# Altium schematic sheet InternalConnection.SchDoc
size 420 x 297 mm; Address1: Address1; Address2: Address2; Address3: Address3; Address4: Address4; SheetNumber: 2; SheetTotal: 5; Scale: 1:1; DocumentType: Схема электрическая принципиальная
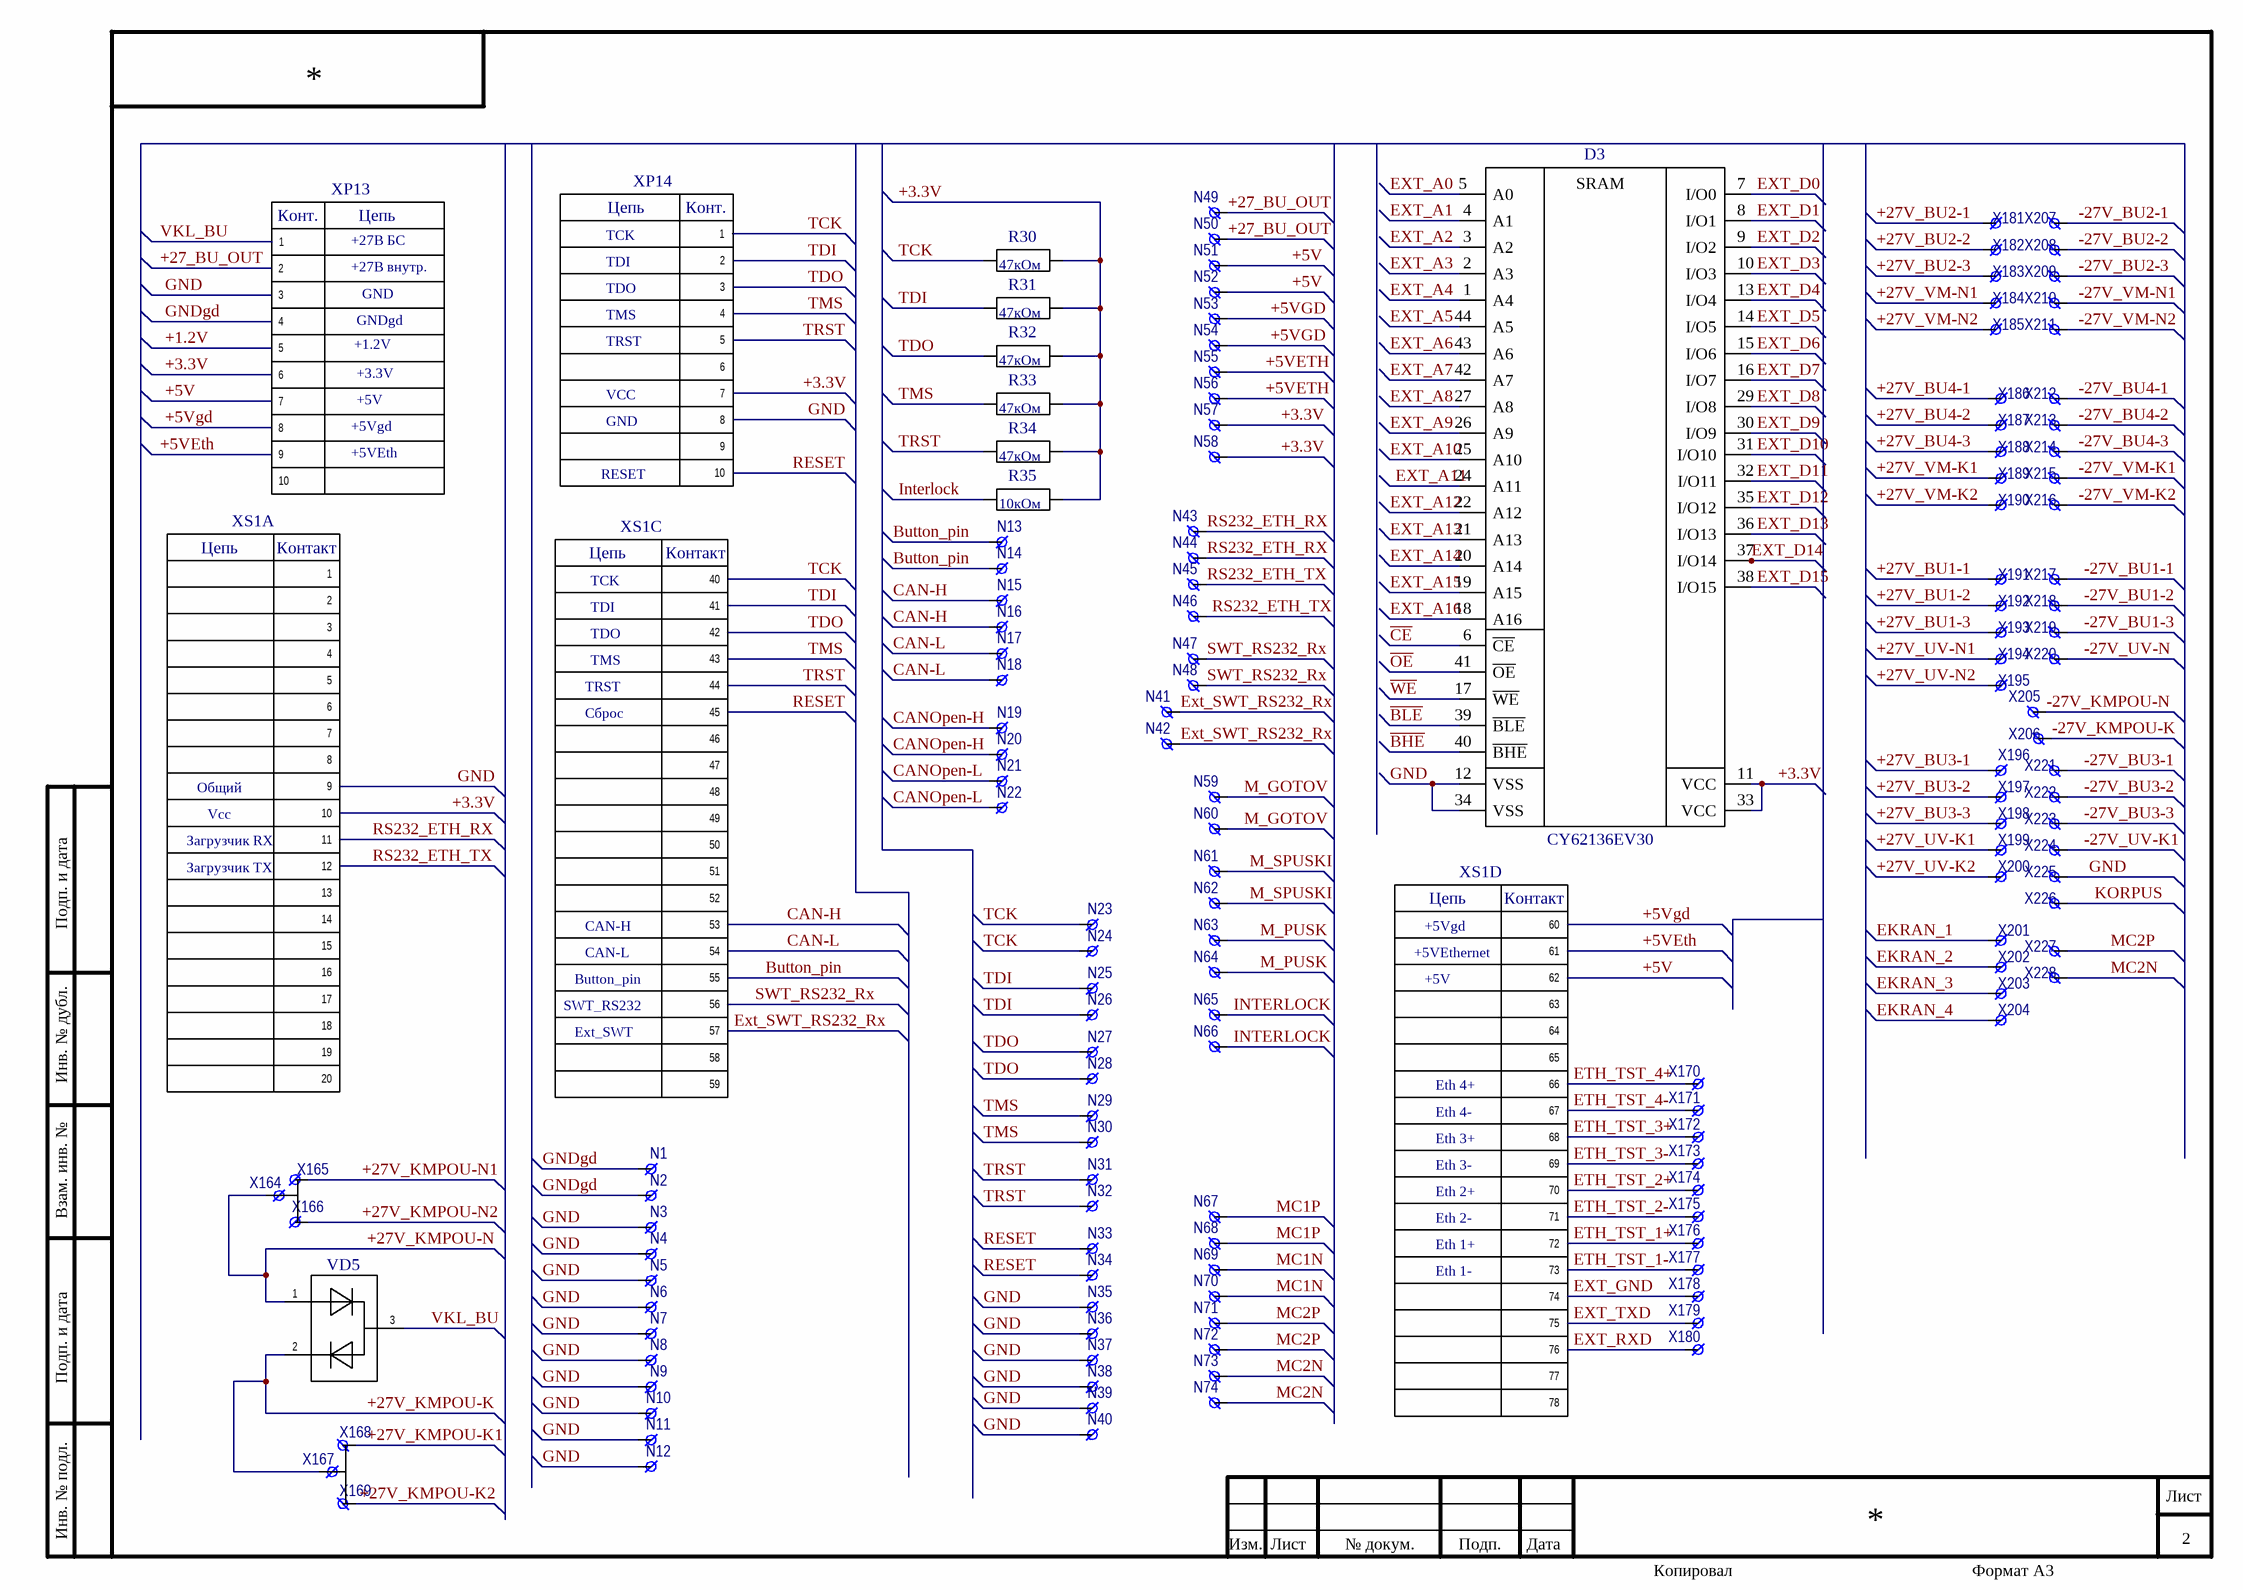
[diagram p0: InternalConnection.SchDoc]

## Parts
D3  CY62136EV30  [TSOP-44]
N1  CONT  [ПЛАН_ПЛОЩ]  (value not drawn)
N2  CONT  [ПЛАН_ПЛОЩ]  (value not drawn)
N3  CONT  [ПЛАН_ПЛОЩ]  (value not drawn)
N4  CONT  [ПЛАН_ПЛОЩ]  (value not drawn)
N5  CONT  [ПЛАН_ПЛОЩ]  (value not drawn)
N6  CONT  [ПЛАН_ПЛОЩ]  (value not drawn)
N7  CONT  [ПЛАН_ПЛОЩ]  (value not drawn)
N8  CONT  [ПЛАН_ПЛОЩ]  (value not drawn)
N9  CONT  [ПЛАН_ПЛОЩ]  (value not drawn)
N10  CONT  [ПЛАН_ПЛОЩ]  (value not drawn)
N11  CONT  [ПЛАН_ПЛОЩ]  (value not drawn)
N12  CONT  [ПЛАН_ПЛОЩ]  (value not drawn)
N13  CONT  [ПЛАН_ПЛОЩ]  (value not drawn)
N14  CONT  [ПЛАН_ПЛОЩ]  (value not drawn)
N15  CONT  [ПЛАН_ПЛОЩ]  (value not drawn)
N16  CONT  [ПЛАН_ПЛОЩ]  (value not drawn)
N17  CONT  [ПЛАН_ПЛОЩ]  (value not drawn)
N18  CONT  [ПЛАН_ПЛОЩ]  (value not drawn)
N19  CONT  [ПЛАН_ПЛОЩ]  (value not drawn)
N20  CONT  [ПЛАН_ПЛОЩ]  (value not drawn)
N21  CONT  [ПЛАН_ПЛОЩ]  (value not drawn)
N22  CONT  [ПЛАН_ПЛОЩ]  (value not drawn)
N23  CONT  [ПЛАН_ПЛОЩ]  (value not drawn)
N24  CONT  [ПЛАН_ПЛОЩ]  (value not drawn)
N25  CONT  [ПЛАН_ПЛОЩ]  (value not drawn)
N26  CONT  [ПЛАН_ПЛОЩ]  (value not drawn)
N27  CONT  [ПЛАН_ПЛОЩ]  (value not drawn)
N28  CONT  [ПЛАН_ПЛОЩ]  (value not drawn)
N29  CONT  [ПЛАН_ПЛОЩ]  (value not drawn)
N30  CONT  [ПЛАН_ПЛОЩ]  (value not drawn)
N31  CONT  [ПЛАН_ПЛОЩ]  (value not drawn)
N32  CONT  [ПЛАН_ПЛОЩ]  (value not drawn)
N33  CONT  [ПЛАН_ПЛОЩ]  (value not drawn)
N34  CONT  [ПЛАН_ПЛОЩ]  (value not drawn)
N35  CONT  [ПЛАН_ПЛОЩ]  (value not drawn)
N36  CONT  [ПЛАН_ПЛОЩ]  (value not drawn)
N37  CONT  [ПЛАН_ПЛОЩ]  (value not drawn)
N38  CONT  [ПЛАН_ПЛОЩ]  (value not drawn)
N39  CONT  [ПЛАН_ПЛОЩ]  (value not drawn)
N40  CONT  [ПЛАН_ПЛОЩ]  (value not drawn)
N41  CONT  [ПЛАН_ПЛОЩ]  (value not drawn)
N42  CONT  [ПЛАН_ПЛОЩ]  (value not drawn)
N43  CONT  [ПЛАН_ПЛОЩ]  (value not drawn)
N44  CONT  [ПЛАН_ПЛОЩ]  (value not drawn)
N45  CONT  [ПЛАН_ПЛОЩ]  (value not drawn)
N46  CONT  [ПЛАН_ПЛОЩ]  (value not drawn)
N47  CONT  [ПЛАН_ПЛОЩ]  (value not drawn)
N48  CONT  [ПЛАН_ПЛОЩ]  (value not drawn)
N49  CONT  [ПЛАН_ПЛОЩ]  (value not drawn)
N50  CONT  [ПЛАН_ПЛОЩ]  (value not drawn)
N51  CONT  [ПЛАН_ПЛОЩ]  (value not drawn)
N52  CONT  [ПЛАН_ПЛОЩ]  (value not drawn)
N53  CONT  [ПЛАН_ПЛОЩ]  (value not drawn)
N54  CONT  [ПЛАН_ПЛОЩ]  (value not drawn)
N55  CONT  [ПЛАН_ПЛОЩ]  (value not drawn)
N56  CONT  [ПЛАН_ПЛОЩ]  (value not drawn)
N57  CONT  [ПЛАН_ПЛОЩ]  (value not drawn)
N58  CONT  [ПЛАН_ПЛОЩ]  (value not drawn)
N59  CONT  [ПЛАН_ПЛОЩ]  (value not drawn)
N60  CONT  [ПЛАН_ПЛОЩ]  (value not drawn)
N61  CONT  [ПЛАН_ПЛОЩ]  (value not drawn)
N62  CONT  [ПЛАН_ПЛОЩ]  (value not drawn)
N63  CONT  [ПЛАН_ПЛОЩ]  (value not drawn)
N64  CONT  [ПЛАН_ПЛОЩ]  (value not drawn)
N65  CONT  [ПЛАН_ПЛОЩ]  (value not drawn)
N66  CONT  [ПЛАН_ПЛОЩ]  (value not drawn)
N67  CONT  [ПЛАН_ПЛОЩ]  (value not drawn)
N68  CONT  [ПЛАН_ПЛОЩ]  (value not drawn)
N69  CONT  [ПЛАН_ПЛОЩ]  (value not drawn)
N70  CONT  [ПЛАН_ПЛОЩ]  (value not drawn)
N71  CONT  [ПЛАН_ПЛОЩ]  (value not drawn)
N72  CONT  [ПЛАН_ПЛОЩ]  (value not drawn)
N73  CONT  [ПЛАН_ПЛОЩ]  (value not drawn)
N74  CONT  [ПЛАН_ПЛОЩ]  (value not drawn)
R30  47кОм  [P1-12-0.125(0805)]
R31  47кОм  [P1-12-0.125(0805)]
R32  47кОм  [P1-12-0.125(0805)]
R33  47кОм  [P1-12-0.125(0805)]
R34  47кОм  [P1-12-0.125(0805)]
R35  10кОм  [P1-12-0.125(0805)]
VD5  2Д707АС9  [KT-46]  (value not drawn)
X164  CONT  [ПЛАН_ПЛОЩ]  (value not drawn)
X165  CONT  [ПЛАН_ПЛОЩ]  (value not drawn)
X166  CONT  [ПЛАН_ПЛОЩ]  (value not drawn)
X167  CONT  [ПЛАН_ПЛОЩ]  (value not drawn)
X168  CONT  [ПЛАН_ПЛОЩ]  (value not drawn)
X169  CONT  [ПЛАН_ПЛОЩ]  (value not drawn)
X170  CONT  [ПЛАН_ПЛОЩ]  (value not drawn)
X171  CONT  [ПЛАН_ПЛОЩ]  (value not drawn)
X172  CONT  [ПЛАН_ПЛОЩ]  (value not drawn)
X173  CONT  [ПЛАН_ПЛОЩ]  (value not drawn)
X174  CONT  [ПЛАН_ПЛОЩ]  (value not drawn)
X175  CONT  [ПЛАН_ПЛОЩ]  (value not drawn)
X176  CONT  [ПЛАН_ПЛОЩ]  (value not drawn)
X177  CONT  [ПЛАН_ПЛОЩ]  (value not drawn)
X178  CONT  [ПЛАН_ПЛОЩ]  (value not drawn)
X179  CONT  [ПЛАН_ПЛОЩ]  (value not drawn)
X180  CONT  [ПЛАН_ПЛОЩ]  (value not drawn)
X181  CONT  [ПЛАН_ПЛОЩ]  (value not drawn)
X182  CONT  [ПЛАН_ПЛОЩ]  (value not drawn)
X183  CONT  [ПЛАН_ПЛОЩ]  (value not drawn)
X184  CONT  [ПЛАН_ПЛОЩ]  (value not drawn)
X185  CONT  [ПЛАН_ПЛОЩ]  (value not drawn)
X186  CONT  [ПЛАН_ПЛОЩ]  (value not drawn)
X187  CONT  [ПЛАН_ПЛОЩ]  (value not drawn)
X188  CONT  [ПЛАН_ПЛОЩ]  (value not drawn)
X189  CONT  [ПЛАН_ПЛОЩ]  (value not drawn)
X190  CONT  [ПЛАН_ПЛОЩ]  (value not drawn)
X191  CONT  [ПЛАН_ПЛОЩ]  (value not drawn)
X192  CONT  [ПЛАН_ПЛОЩ]  (value not drawn)
X193  CONT  [ПЛАН_ПЛОЩ]  (value not drawn)
X194  CONT  [ПЛАН_ПЛОЩ]  (value not drawn)
X195  CONT  [ПЛАН_ПЛОЩ]  (value not drawn)
X196  CONT  [ПЛАН_ПЛОЩ]  (value not drawn)
X197  CONT  [ПЛАН_ПЛОЩ]  (value not drawn)
X198  CONT  [ПЛАН_ПЛОЩ]  (value not drawn)
X199  CONT  [ПЛАН_ПЛОЩ]  (value not drawn)
X200  CONT  [ПЛАН_ПЛОЩ]  (value not drawn)
X201  CONT  [ПЛАН_ПЛОЩ]  (value not drawn)
X202  CONT  [ПЛАН_ПЛОЩ]  (value not drawn)
X203  CONT  [ПЛАН_ПЛОЩ]  (value not drawn)
X204  CONT  [ПЛАН_ПЛОЩ]  (value not drawn)
X205  CONT  [ПЛАН_ПЛОЩ]  (value not drawn)
X206  CONT  [ПЛАН_ПЛОЩ]  (value not drawn)
X207  CONT  [ПЛАН_ПЛОЩ]  (value not drawn)
X208  CONT  [ПЛАН_ПЛОЩ]  (value not drawn)
X209  CONT  [ПЛАН_ПЛОЩ]  (value not drawn)
X210  CONT  [ПЛАН_ПЛОЩ]  (value not drawn)
X211  CONT  [ПЛАН_ПЛОЩ]  (value not drawn)
X212  CONT  [ПЛАН_ПЛОЩ]  (value not drawn)
X213  CONT  [ПЛАН_ПЛОЩ]  (value not drawn)
X214  CONT  [ПЛАН_ПЛОЩ]  (value not drawn)
X215  CONT  [ПЛАН_ПЛОЩ]  (value not drawn)
X216  CONT  [ПЛАН_ПЛОЩ]  (value not drawn)
X217  CONT  [ПЛАН_ПЛОЩ]  (value not drawn)
X218  CONT  [ПЛАН_ПЛОЩ]  (value not drawn)
X219  CONT  [ПЛАН_ПЛОЩ]  (value not drawn)
X220  CONT  [ПЛАН_ПЛОЩ]  (value not drawn)
X221  CONT  [ПЛАН_ПЛОЩ]  (value not drawn)
X222  CONT  [ПЛАН_ПЛОЩ]  (value not drawn)
X223  CONT  [ПЛАН_ПЛОЩ]  (value not drawn)
X224  CONT  [ПЛАН_ПЛОЩ]  (value not drawn)
X225  CONT  [ПЛАН_ПЛОЩ]  (value not drawn)
X226  CONT  [ПЛАН_ПЛОЩ]  (value not drawn)
X227  CONT  [ПЛАН_ПЛОЩ]  (value not drawn)
X228  CONT  [ПЛАН_ПЛОЩ]  (value not drawn)
XP13  PBS-10(R)  [PBS-10R]  (value not drawn)
XP14  ARM10PIN_КОНТ  [PLD-10]  (value not drawn)
XS1  ВИЛКА DS1077-78M  [DS-1077-78F]  (value not drawn)  (parts A,C,D of 4)

## Nets
+1.2V: XP13.5
+3.3V: D3.11(VCC) D3.33(VCC) N57.1 N58.1 R30.2 R31.2 R32.2 R33.2 R34.2 R35.2 XP13.6 XP14.7 XS1.10
+5V: N51.1 N52.1 XP13.7 XS1.62
+5VETH: N55.1 N56.1 XP13.9 XS1.61
+5VGD: N53.1 N54.1 XP13.8 XS1.60
+27_BU_OUT: N49.1 N50.1 XP13.2
+27V_BU1-1: X191.1
+27V_BU1-2: X192.1
+27V_BU1-3: X193.1
+27V_BU2-1: X181.1
+27V_BU2-2: X182.1
+27V_BU2-3: X183.1
+27V_BU3-1: X196.1
+27V_BU3-2: X197.1
+27V_BU3-3: X198.1
+27V_BU4-1: X186.1
+27V_BU4-2: X187.1
+27V_BU4-3: X188.1
+27V_KMPOU-K: VD5.2 X167.1
+27V_KMPOU-K1: X168.1
+27V_KMPOU-K2: X169.1
+27V_KMPOU-N: VD5.1 X164.1
+27V_KMPOU-N1: X165.1
+27V_KMPOU-N2: X166.1
+27V_UV-K1: X199.1
+27V_UV-K2: X200.1
+27V_UV-N1: X194.1
+27V_UV-N2: X195.1
+27V_VM-K1: X189.1
+27V_VM-K2: X190.1
+27V_VM-N1: X184.1
+27V_VM-N2: X185.1
-27V_BU1-1: X217.1
-27V_BU1-2: X218.1
-27V_BU1-3: X219.1
-27V_BU2-1: X207.1
-27V_BU2-2: X208.1
-27V_BU2-3: X209.1
-27V_BU3-1: X221.1
-27V_BU3-2: X222.1
-27V_BU3-3: X223.1
-27V_BU4-1: X212.1
-27V_BU4-2: X213.1
-27V_BU4-3: X214.1
-27V_KMPOU-K: X206.1
-27V_KMPOU-N: X205.1
-27V_UV-K1: X224.1
-27V_UV-N: X220.1
-27V_VM-K1: X215.1
-27V_VM-K2: X216.1
-27V_VM-N1: X210.1
-27V_VM-N2: X211.1
~{BHE}: D3.40(~{BHE})
~{BLE}: D3.39(~{BLE})
~{CE}: D3.6(~{CE})
~{OE}: D3.41(~{OE})
~{WE}: D3.17(~{WE})
Button_pin: N13.1 N14.1 XS1.55
CAN-H: N15.1 N16.1 XS1.53
CAN-L: N17.1 N18.1 XS1.54
CANOpen-H: N19.1 N20.1
CANOpen-L: N21.1 N22.1
EKRAN_1: X201.1
EKRAN_2: X202.1
EKRAN_3: X203.1
EKRAN_4: X204.1
ETH_TST_1+: X176.1 XS1.72
ETH_TST_1-: X177.1 XS1.73
ETH_TST_2+: X174.1 XS1.70
ETH_TST_2-: X175.1 XS1.71
ETH_TST_3+: X172.1 XS1.68
ETH_TST_3-: X173.1 XS1.69
ETH_TST_4+: X170.1 XS1.66
ETH_TST_4-: X171.1 XS1.67
EXT_A0: D3.5(A0)
EXT_A1: D3.4(A1)
EXT_A2: D3.3(A2)
EXT_A3: D3.2(A3)
EXT_A4: D3.1(A4)
EXT_A5: D3.44(A5)
EXT_A6: D3.43(A6)
EXT_A7: D3.42(A7)
EXT_A8: D3.27(A8)
EXT_A9: D3.26(A9)
EXT_A10: D3.25(A10)
EXT_A11: D3.24(A11)
EXT_A12: D3.22(A12)
EXT_A13: D3.21(A13)
EXT_A14: D3.20(A14)
EXT_A15: D3.19(A15)
EXT_A16: D3.18(A16)
EXT_D0: D3.7(I/O0)
EXT_D1: D3.8(I/O1)
EXT_D2: D3.9(I/O2)
EXT_D3: D3.10(I/O3)
EXT_D4: D3.13(I/O4)
EXT_D5: D3.14(I/O5)
EXT_D6: D3.15(I/O6)
EXT_D7: D3.16(I/O7)
EXT_D8: D3.29(I/O8)
EXT_D9: D3.30(I/O9)
EXT_D10: D3.31(I/O10)
EXT_D11: D3.32(I/O11)
EXT_D12: D3.35(I/O12)
EXT_D13: D3.36(I/O13)
EXT_D14: D3.37(I/O14)
EXT_D15: D3.38(I/O15)
EXT_GND: X178.1 XS1.74
EXT_RXD: X180.1 XS1.76
Ext_SWT_RS232_Rx: N41.1 N42.1 XS1.57
EXT_TXD: X179.1 XS1.75
GND: D3.12(VSS) D3.34(VSS) N3.1 N4.1 N5.1 N6.1 N7.1 N8.1 N9.1 N10.1 N11.1 N12.1 N35.1 N36.1 N37.1 N38.1 N39.1 N40.1 X225.1 XP13.3 XP14.8 XS1.9
GNDgd: N1.1 N2.1 XP13.4
Interlock: N65.1 N66.1 R35.1
KORPUS: X226.1
M_GOTOV: N59.1 N60.1
M_PUSK: N63.1 N64.1
M_SPUSKI: N61.1 N62.1
MC1N: N69.1 N70.1
MC1P: N67.1 N68.1
MC2N: N73.1 N74.1 X228.1
MC2P: N71.1 N72.1 X227.1
RESET: N33.1 N34.1 XP14.10 XS1.45
RS232_ETH_RX: N43.1 N44.1 XS1.11
RS232_ETH_TX: N45.1 N46.1 XS1.12
SWT_RS232_Rx: N47.1 N48.1 XS1.56
TCK: N23.1 N24.1 R30.1 XP14.1 XS1.40
TDI: N25.1 N26.1 R31.1 XP14.2 XS1.41
TDO: N27.1 N28.1 R32.1 XP14.3 XS1.42
TMS: N29.1 N30.1 R33.1 XP14.4 XS1.43
TRST: N31.1 N32.1 R34.1 XP14.5 XS1.44
VKL_BU: VD5.3 XP13.1

Not connected (* = marked no-connect by the designer): XP13 10; XP14 6 9; XS1 1 2 3 4 5 6 7 8 13 14 15 16 17 18 19 20 46 47 48 49 50 51 52 58 59 63 64 65 77 78

## Notes on the sheet
- +27В БС
- TCK
- +27В внутр.
- GNDgd
- GND
- TDI
- TDO
- TMS
- +1.2V
- +3.3V
- TRST
- +5Vgd
- +5VEth
- +5V
- VCC
- RESET
- Сброс
- Общий
- Загрузчик RX
- Vcc
- Подп. и дата
- Загрузчик TX
- CAN-H
- Button_pin
- CAN-L
- +5VEthernet
- SWT_RS232
- Ext_SWT
- Инв. № дубл.
- Eth 4+
- Eth 4-
- Eth 3+
- Eth 3-
- Eth 2+
- Взам. инв. №
- Eth 2-
- Eth 1+
- Eth 1-
- Инв. № подл.
- Изм.
- Лист
- № докум.
- Подп.
- Дата
- Копировал
- Формат А3
- (in symbol ARM10PIN_КОНТ) Цепь; Конт.
- (in symbol CY62136EV30) SRAM
- (in symbol PBS-10(R)) Конт.; Цепь
- (in symbol ВИЛКА DS1077-78M, part A) Цепь; Контакт
- (in symbol ВИЛКА DS1077-78M, part C) Цепь; Контакт
- (in symbol ВИЛКА DS1077-78M, part D) Цепь; Контакт

## Library data of the parts
D3 = CY62136EV30: СОЗУ CY62136EV30 256КБ; TypePrefix: Статическая память; TUHolder: "Cypress Semiconductor",США; Prefix: D; Value: 256 КБ; PartNumber: CY62136EV30; TU: *
N1-N74 X164-X228 = CONT: CONT1_SMD; PartNumber: контактное поле; Value: *
R30-R34 = Р1-12_47k: Постоянные непроволочные безвыводные резисторы общего применения Р1-12; PartNumber: Р1-12-*-*±*%-*; TU: АЛЯР.434110.005 ТУ; TUHolder: ЗАО "РЕОМ"; TypePrefix: R; PackegeType: *; Value: *
R35 = Р1-12_10k: Постоянные непроволочные безвыводные резисторы общего применения Р1-12; PartNumber: Р1-12-*-*±*%-*; TU: АЛЯР.434110.005 ТУ; TUHolder: ЗАО "РЕОМ"; TypePrefix: R; PackegeType: *; Value: *
VD5 = 2Д707АС9: 2Д707АС9 диод импульсный; TU: аА0.339.583ТУ; TUHolder: ООО "НПК ДАЛЕКС"; TypePrefix: VD; Value: *; PartNumber: 2Д707АС9
XP13 = PBS-10(R): Value: B10B-PUDSS-1, JST (JAPAN SOLDERLESS TERMINALS)
XP14 = ARM10PIN_КОНТ: Value: Вилка СНП346-10ВП21-2В; TU: РЮМК.430420.011ТУ
XS1 = ВИЛКА DS1077-78M: Value: DS1077-78FB8(0)TSS, Connfly Electronic